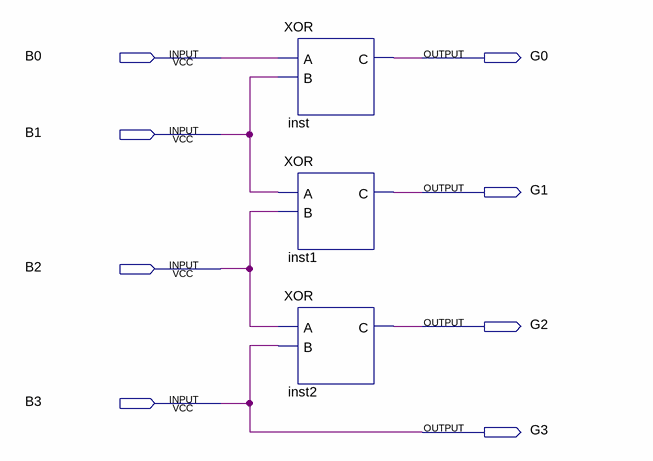
[diagram p0: schematic sheet]
// Quartus schematic BinaryToGray.bdf as structural Verilog: 3 symbols, 8 pins
module BinaryToGray (
  input  B0,
  input  B1,
  input  B2,
  input  B3,
  output G0,
  output G1,
  output G2,
  output G3
);

  XOR inst (.A(B0), .B(B1), .C(G0));
  XOR inst1 (.A(B1), .B(B2), .C(G1));
  XOR inst2 (.A(B2), .B(B3), .C(G2));

  assign G3 = B3;
endmodule
